# EAGLE design UIAPduino_Pro_Micro_CH32V006_V1dot1 (EAGLE 9.6.2)

## Sheet 1 of 2
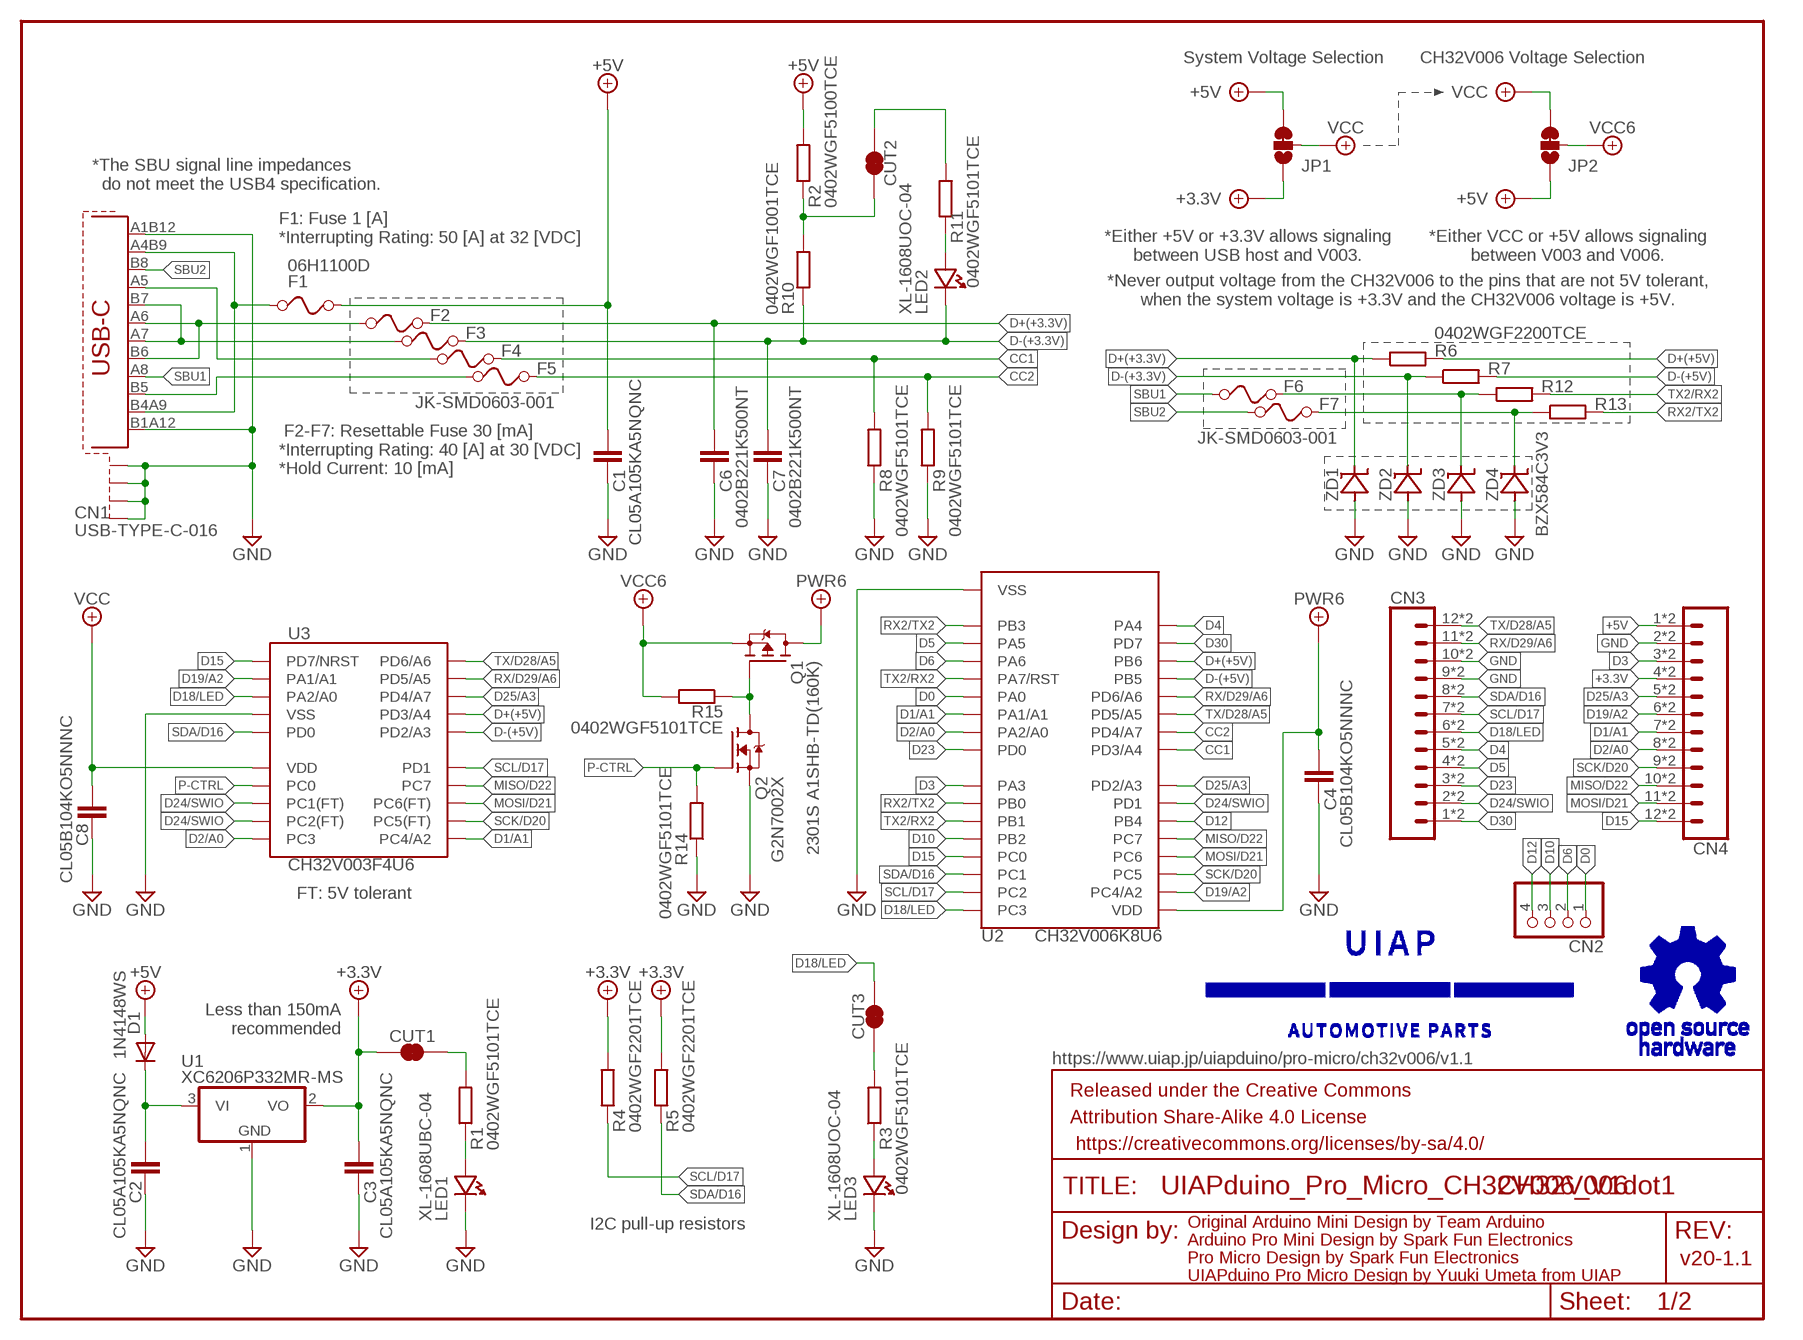
[diagram p0: schematic, sheet 1]

### Parts
C1  CL05A105KA5NQNC  C1005  [1005]
C2  CL05A105KA5NQNC  C1005  [1005]
C3  CL05A105KA5NQNC  C1005  [1005]
C4  CL05B104KO5NNNC  C1005  [1005]
C6  0402B221K500NT  C1005  [1005]
C7  0402B221K500NT  C1005  [1005]
C8  CL05B104KO5NNNC  C1005  [1005]
CN1  USB-TYPE-C-016  [USB-TYPE-C-016]
CN2  PH-2X2  [2X02]
CN3  CONN_12CASTLE_0.9MM  [1X12_CASTELLATED_0.9MM]
CN4  CONN_12CASTLE_0.9MM  [1X12_CASTELLATED_0.9MM]
CUT1  SMT-JP-2-NC  [SMT-JUMPER_2_NC_SILK_ROUND]
CUT2  SMT-JP-2-NC  [SMT-JUMPER_2_NC_SILK_ROUND]
CUT3  SMT-JP-2-NC  [SMT-JUMPER_2_NC_SILK_ROUND]
D1  1N4148WS  1N4148WT  [SOD-523]
F1  06H1100D  [1608]
F2  JK-SMD0603-001  06H1100D  [1608]
F3  JK-SMD0603-001  06H1100D  [1608]
F4  JK-SMD0603-001  06H1100D  [1608]
F5  JK-SMD0603-001  06H1100D  [1608]
F6  JK-SMD0603-001  06H1100D  [1608]
F7  JK-SMD0603-001  06H1100D  [1608]
FRAME1  FRAME-LETTER  [CREATIVE_COMMONS]
JP1  SMT-JP-3-NO-NC  [SMT-JUMPER_3_1-NC_TRACE_SILK]
JP2  SMT-JP-3-NO-NC  [SMT-JUMPER_3_1-NC_TRACE_SILK]
LED1  XL-1608UBC-04  [1608-LED]
LED2  XL-1608UOC-04  [1608-LED]
LED3  XL-1608UOC-04  [1608-LED]
Q1  2301S A1SHB-TD(160K)  2301S_A1SHB-TD(160K)  [SOT-23F_TOS-L]
Q2  G2N7002X  [SOT-523]
R1  0402WGF5101TCE  R1005  [1005]
R2  0402WGF5100TCE  R1005  [1005]
R3  0402WGF5101TCE  R1005  [1005]
R4  0402WGF2201TCE  R1005  [1005]
R5  0402WGF2201TCE  R1005  [1005]
R6  0402WGF2200TCE  R1005  [1005]
R7  0402WGF2200TCE  R1005  [1005]
R8  0402WGF5101TCE  R1005  [1005]
R9  0402WGF5101TCE  R1005  [1005]
R10  0402WGF1001TCE  R1005  [1005]
R11  0402WGF5101TCE  R1005  [1005]
R12  0402WGF2200TCE  R1005  [1005]
R13  0402WGF2200TCE  R1005  [1005]
R14  0402WGF5101TCE  R1005  [1005]
R15  0402WGF5101TCE  R1005  [1005]
U1  XC6206P332MR-MS  [SOT-23F_TOS-L]
U2  CH32V006K8U6  [QFN32-400X400X100]
U3  CH32V003F4U6  CH32V003F4U6-L  [QFN20-300X300X100-L]
ZD1  BZX584C3V3  [SOD-523]
ZD2  BZX584C3V3  [SOD-523]
ZD3  BZX584C3V3  [SOD-523]
ZD4  BZX584C3V3  [SOD-523]

### Nets
+3.3V [vcc]: C3.1 CN4.4 CN4.4B CUT1.2 JP1.1 R4.2 R5.2 U1.2(VO)
+5V [vcc]: C1.1 CN4.1 CN4.1B D1.2(A) F1.2 JP1.3 JP2.1 R2.2
CC1: F4.2 R8.2 U2.25(PD3/A4)
CC2: F5.2 R9.2 U2.26(PD4/A7)
CUT1: CUT1.1 R1.2
D0: CN2.1 U2.5(PA0)
D1 [vcc]: C2.1 D1.1(C) U1.3(VI)
D1/A1: CN4.7 CN4.7B U2.6(PA1/A1) U3.11(PC4/A2)
D2/A0: CN4.8 CN4.8B U2.7(PA2/A0) U3.10(PC3)
D3: CN4.3 CN4.3B U2.9(PA3)
D4: CN3.5 CN3.5B U2.32(PA4)
D5: CN3.4 CN3.4B U2.2(PA5)
D6: CN2.2 U2.3(PA6)
D10: CN2.3 U2.12(PB2)
D12: CN2.4 U2.22(PB4)
D15: CN4.12 CN4.12B U2.13(PC0) U3.1(PD7/NRST)
D18/LED: CN3.6 CN3.6B CUT3.1 U2.16(PC3) U3.3(PA2/A0)
D19/A2: CN4.6 CN4.6B U2.18(PC4/A2) U3.2(PA1/A1)
D23: CN3.3 CN3.3B U2.8(PD0)
D24/SWIO: CN3.2 CN3.2B U2.23(PD1) U3.8(PC1(FT)) U3.9(PC2(FT))
D25/A3: CN4.5 CN4.5B U2.24(PD2/A3) U3.18(PD4/A7)
D30: CN3.1 CN3.1B U2.31(PD7)
D+(+3.3V): C6.1 F2.2 R6.1 ZD1.1(C)
D+(+5V): R6.2 U2.30(PB6) U3.17(PD3/A4)
D-(+3.3V): C7.1 F3.2 LED2.2(C) R7.1 R10.1 ZD2.1(C)
D-(+5V): R7.2 U2.29(PB5) U3.16(PD2/A3)
F1 [vcc]: CN1.A4B9(VBUS) CN1.B4A9(VBUS) F1.1
GND [GND]: C1.2 C2.2 C3.2 C4.2 C6.2 C7.2 C8.2 CN1.A1B12(GND) CN1.B1A12(GND) CN1.S1 CN1.S1B(S1) CN1.S2 CN1.S2B(S2) CN1.S3 CN1.S3B(S3) CN1.S4 CN1.S4B(S4) CN3.9 CN3.9B CN3.10 CN3.10B CN4.2 CN4.2B LED1.2(C) LED3.2(C) Q2.2(S) R8.1 R9.1 R14.1 U1.1(GND) U2.0(VSS) U2.P-VIA$1(VSS) U2.P-VIA$5(VSS) U2.P-VIA$6(VSS) U2.P-VIA$8(VSS) U2.P-VIA$9(VSS) U3.4(VSS) U3.21(VSS) U3.P-VIA$1(VSS) ZD1.2(A) ZD2.2(A) ZD3.2(A) ZD4.2(A)
MISO/D22: CN4.10 CN4.10B U2.21(PC7) U3.14(PC7)
MOSI/D21: CN4.11 CN4.11B U2.20(PC6) U3.13(PC6(FT))
N$1: CN1.A6(DP1) CN1.B6(DP2) F2.1
N$2: CUT2.2 R2.1 R10.2
N$3: Q1.1(G) Q2.3(D) R15.1
N$4: CN1.A7(DN1) CN1.B7(DN2) F3.1
N$5: CN1.A5(CC1) F4.1
N$6: F6.2 R12.1 ZD3.1(C)
N$7: LED3.1(A) R3.1
N$8: CN1.B5(CC2) F5.1
N$9: LED2.1(A) R11.1
N$10: CUT3.2 R3.2
N$11: CUT2.1 R11.2
N$12: F7.2 R13.1 ZD4.1(C)
N$38: LED1.1(A) R1.1
P-CTRL: Q2.1(G) R14.2 U3.7(PC0)
PWR6 [vcc]: C4.1 Q1.3(D) U2.17(VDD)
RX2/TX2: R13.2 U2.1(PB3) U2.10(PB0)
RX/D29/A6: CN3.11 CN3.11B U2.28(PD6/A6) U3.19(PD5/A5)
SBU1: CN1.A8(SBU1) F6.1
SBU2: CN1.B8(SBU2) F7.1
SCK/D20: CN4.9 CN4.9B U2.19(PC5) U3.12(PC5(FT))
SCL/D17: CN3.7 CN3.7B R4.1 U2.15(PC2) U3.15(PD1)
SDA/D16: CN3.8 CN3.8B R5.1 U2.14(PC1) U3.5(PD0)
TX2/RX2: R12.2 U2.4(PA7/RST) U2.11(PB1)
TX/D28/A5: CN3.12 CN3.12B U2.27(PD5/A5) U3.20(PD6/A6)
VCC [vcc]: C8.1 JP1.2 JP2.3 U3.6(VDD)
VCC6 [vcc]: JP2.2 Q1.2(S) R15.2

### Notes on the sheet
- System Voltage Selection | CH32V006 Voltage Selection
- *The SBU signal line impedances
    do not meet the USB4 specification.
- F1: Fuse 1 [A]
  *Interrupting Rating: 50 [A] at 32 [VDC]
- *Either +5V or +3.3V allows signaling
  between USB host and V003.
- *Either VCC or +5V allows signaling
  between V003 and V006.
- *Never output voltage from the CH32V006 to the pins that are not 5V tolerant,
  when the system voltage is +3.3V and the CH32V006 voltage is +5V.
- F2-F7: Resettable Fuse 30 [mA]
  *Interrupting Rating: 40 [A] at 30 [VDC]
  *Hold Current: 10 [mA]
- FT: 5V tolerant
- Less than 150mA
  recommended
- https://www.uiap.jp/uiapduino/pro-micro/ch32v006/v1.1
- CH32V006
- Original Arduino Mini Design by Team Arduino
- I2C pull-up resistors | Arduino Pro Mini Design by Spark Fun Electronics
- Pro Micro Design by Spark Fun Electronics
- UIAPduino Pro Micro Design by Yuuki Umeta from UIAP | v20-1.1

## Sheet 2 of 2
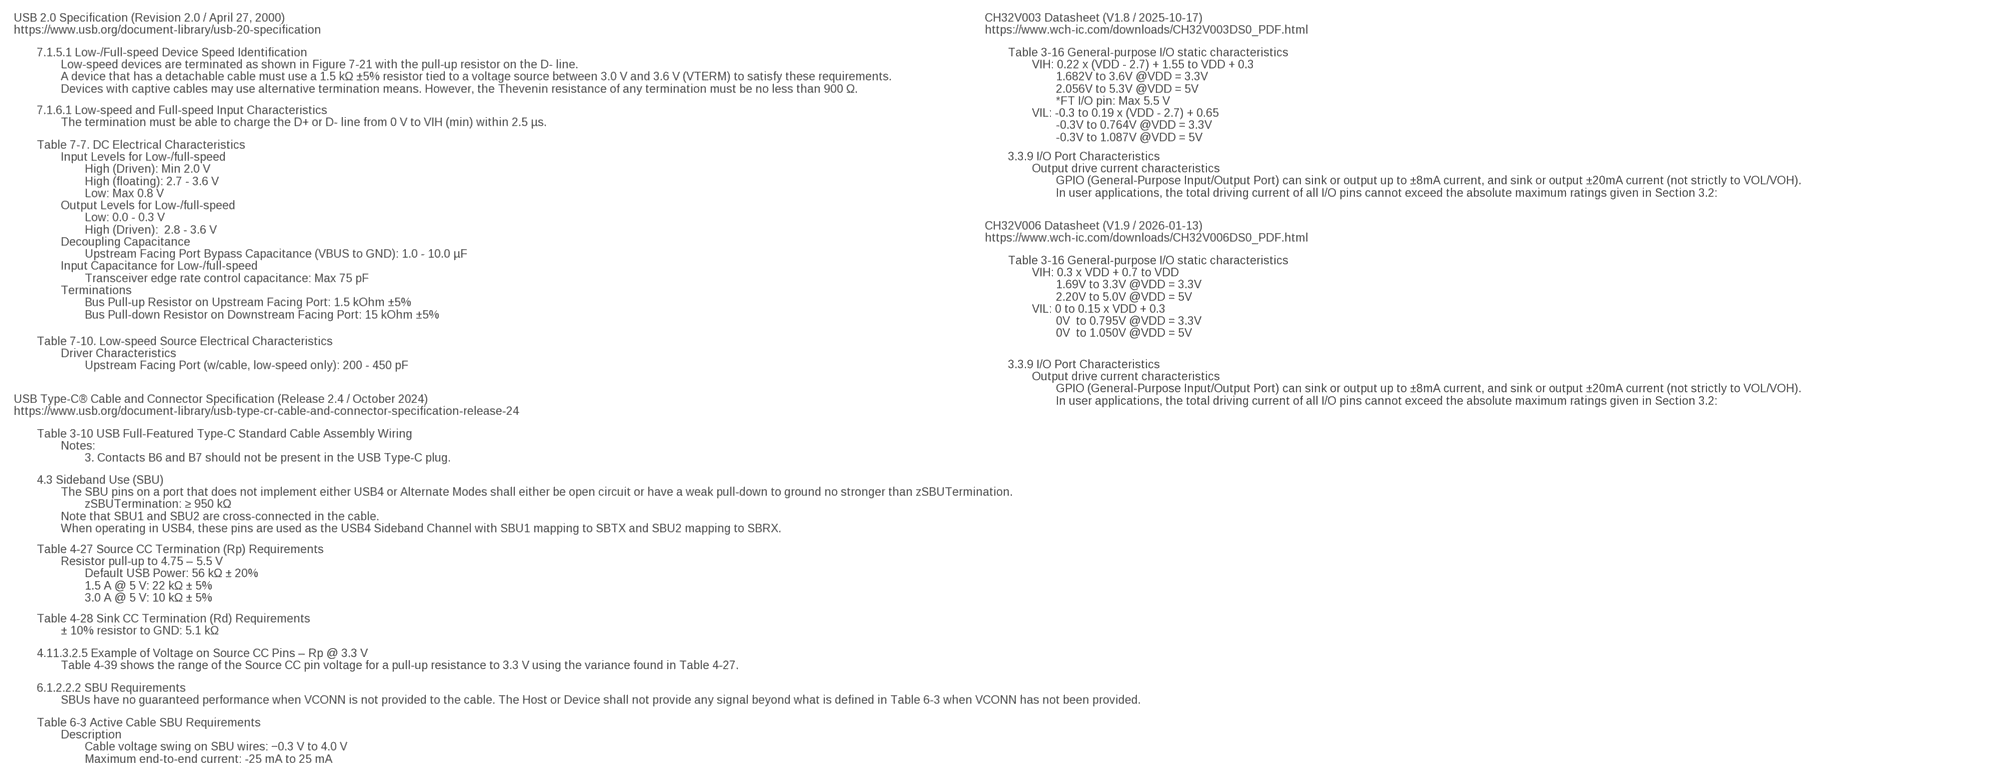
[diagram p1: schematic, sheet 2]

### Notes on the sheet
- USB 2.0 Specification (Revision 2.0 / April 27, 2000)
  https://www.usb.org/document-library/usb-20-specification
- CH32V003 Datasheet (V1.8 / 2025-10-17)
  https://www.wch-ic.com/downloads/CH32V003DS0_PDF.html
- 7.1.5.1 Low-/Full-speed Device Speed Identification
          Low-speed devices are terminated as shown in Figure 7-21 with the pull-up resistor on the D- line.
          A device that has a detachable cable must use a 1.5 kΩ ±5% resistor tied to a voltage source between 3.0 V and 3.6 V (VTERM) to satisfy these requirements.
          Devices with captive cables may use alternative termination means. However, the Thevenin resistance of any termination must be no less than 900 Ω.
- Table 3-16 General-purpose I/O static characteristics
          VIH: 0.22 x (VDD - 2.7) + 1.55 to VDD + 0.3
                  1.682V to 3.6V @VDD = 3.3V
                  2.056V to 5.3V @VDD = 5V
                  *FT I/O pin: Max 5.5 V
          VIL: -0.3 to 0.19 x (VDD - 2.7) + 0.65
                  -0.3V to 0.764V @VDD = 3.3V
                  -0.3V to 1.087V @VDD = 5V
- 7.1.6.1 Low-speed and Full-speed Input Characteristics
          The termination must be able to charge the D+ or D- line from 0 V to VIH (min) within 2.5 µs.
- Table 7-7. DC Electrical Characteristics
          Input Levels for Low-/full-speed
                  High (Driven): Min 2.0 V
                  High (floating): 2.7 - 3.6 V
                  Low: Max 0.8 V
          Output Levels for Low-/full-speed
                  Low: 0.0 - 0.3 V
                  High (Driven):  2.8 - 3.6 V
          Decoupling Capacitance
                  Upstream Facing Port Bypass Capacitance (VBUS to GND): 1.0 - 10.0 µF
          Input Capacitance for Low-/full-speed
                  Transceiver edge rate control capacitance: Max 75 pF
          Terminations
                  Bus Pull-up Resistor on Upstream Facing Port: 1.5 kOhm ±5%
                  Bus Pull-down Resistor on Downstream Facing Port: 15 kOhm ±5%
- 3.3.9 I/O Port Characteristics
          Output drive current characteristics
                  GPIO (General-Purpose Input/Output Port) can sink or output up to ±8mA current, and sink or output ±20mA current (not strictly to VOL/VOH).
                  In user applications, the total driving current of all I/O pins cannot exceed the absolute maximum ratings given in Section 3.2:
- CH32V006 Datasheet (V1.9 / 2026-01-13)
  https://www.wch-ic.com/downloads/CH32V006DS0_PDF.html
- Table 3-16 General-purpose I/O static characteristics
          VIH: 0.3 x VDD + 0.7 to VDD
                  1.69V to 3.3V @VDD = 3.3V
                  2.20V to 5.0V @VDD = 5V
          VIL: 0 to 0.15 x VDD + 0.3
                  0V  to 0.795V @VDD = 3.3V
                  0V  to 1.050V @VDD = 5V
- Table 7-10. Low-speed Source Electrical Characteristics
          Driver Characteristics
                  Upstream Facing Port (w/cable, low-speed only): 200 - 450 pF
- 3.3.9 I/O Port Characteristics
          Output drive current characteristics
                  GPIO (General-Purpose Input/Output Port) can sink or output up to ±8mA current, and sink or output ±20mA current (not strictly to VOL/VOH).
                  In user applications, the total driving current of all I/O pins cannot exceed the absolute maximum ratings given in Section 3.2:
- USB Type-C® Cable and Connector Specification (Release 2.4 / October 2024)
  https://www.usb.org/document-library/usb-type-cr-cable-and-connector-specification-release-24
- Table 3-10 USB Full-Featured Type-C Standard Cable Assembly Wiring
          Notes:
                  3. Contacts B6 and B7 should not be present in the USB Type-C plug.
- 4.3 Sideband Use (SBU)
          The SBU pins on a port that does not implement either USB4 or Alternate Modes shall either be open circuit or have a weak pull-down to ground no stronger than zSBUTermination.
                  zSBUTermination: ≥ 950 kΩ
          Note that SBU1 and SBU2 are cross-connected in the cable.
          When operating in USB4, these pins are used as the USB4 Sideband Channel with SBU1 mapping to SBTX and SBU2 mapping to SBRX.
- Table 4-27 Source CC Termination (Rp) Requirements
          Resistor pull-up to 4.75 – 5.5 V
                  Default USB Power: 56 kΩ ± 20%
                  1.5 A @ 5 V: 22 kΩ ± 5%
                  3.0 A @ 5 V: 10 kΩ ± 5%
- Table 4-28 Sink CC Termination (Rd) Requirements
          ± 10% resistor to GND: 5.1 kΩ
- 4.11.3.2.5 Example of Voltage on Source CC Pins – Rp @ 3.3 V
          Table 4-39 shows the range of the Source CC pin voltage for a pull-up resistance to 3.3 V using the variance found in Table 4-27.
- 6.1.2.2.2 SBU Requirements
          SBUs have no guaranteed performance when VCONN is not provided to the cable. The Host or Device shall not provide any signal beyond what is defined in Table 6-3 when VCONN has not been provided.
- Table 6-3 Active Cable SBU Requirements
          Description
                  Cable voltage swing on SBU wires: −0.3 V to 4.0 V
                  Maximum end-to-end current: -25 mA to 25 mA

## Library data of the parts
C1-C4 C6-C8 = Mylib_e2:C
CN1 = Mylib_e2:USB-TYPE-C; JLCPCB-PART-#: C2927036; URL: https://jlcpcb.com/partdetail/DEALON-USB_TYPE_C016/C2927036
CN2 = Mylib_e2:PH-2X2
CN3 CN4 = Castellated:CONN_12: Multi connection point. Often used as Generic Header-pin footprint for 0.1 inch spaced/style header connections On any of the 0.1 inch spaced packages, you can populate with these: Break Away Headers - Straight <https://www.sparkfun.com/products/116> (PRT-00116) Break Away Male Headers - Right Angle <https://www.sparkfun.com/products/553> (PRT-00553) Female Headers <https://www.sparkfun.com/products/115> (PRT-00115) Break Away Headers - Machine Pin <https://www.sparkfun.com/products/117> (PRT-00117) Break Away Female Headers - Swiss Machine Pin <https://www.sparkfun.com/products/743> (PRT-00743) For SCREWTERMINALS and SPRING TERMINALS visit here: Screw Terimnals on SparkFun.com <https://www.sparkfun.com/search/results?term=Screw+Terminals> (5mm/3.5mm/2.54mm spacing) This device is also useful as a general connection point to wire up your design to another part of your project. Our various solder wires solder well into these plated through hole pads. Hook-Up Wire - Assortment (Stranded, 22 AWG) <https://www.sparkfun.com/products/11375> (PRT-11375) Hook-Up Wire - Assortment (Solid Core, 22 AWG) <https://www.sparkfun.com/products/11367> (PRT-11367) View the entire wire category on our website here <https://www.sparkfun.com/categories/141> Special notes: Molex polarized connector foot print use with SKU : PRT-08231 with associated crimp pins and housings. 1MM SMD Version SKU: PRT-10208 NOTES ON THE VARIANTS LOCK and LOCK_LONGPADS... This footprint was designed to help hold the alignment of a through-hole component (i.e. 6-pin header) while soldering it into place. You may notice that each hole has been shifted either up or down by 0.005 of an inch from it's more standard position (which is a perfectly straight line). This slight alteration caused the pins (the squares in the middle) to touch the edges of the holes. Because they are alternating, it causes a "brace" to hold the component in place. 0.005 has proven to be the perfect amount of "off-center" position when using our standard breakaway headers. Although looks a little odd when you look at the bare footprint, once you have a header in there, the alteration is very hard to notice. Also,if you push a header all the way into place, it is covered up entirely on the bottom side.
CUT1-CUT3 = Mylib_e2:SMT-JP-2-NC
D1 = Mylib_e2:1N4148WT; JLCPCB-PART-#: C917006; URL: https://jlcpcb.com/partdetail/JSMSEMI-1N4148WT/C917006
F1 = Mylib_e2:06H1100D; JLCPCB-PART-#: C182303; URL: https://jlcpcb.com/partdetail/Shenzhen_lansonElec-06H1100D/C182303
F2-F7 = Mylib_e2:06H1100D; JLCPCB-PART-#: C2687114; URL: https://jlcpcb.com/partdetail/2790518-Jinrui_JK_SMD0603001/C2687114
FRAME1 = SparkFun-Aesthetics:FRAME-LETTER: Schematic Frame - Letter Standard 8.5x11 US Letter frame
JP1 JP2 = Mylib_e2:SMT-JP-3-NO-NC
LED1 = Mylib_e2:XL-1608UBC-04; JLCPCB-PART-#: C965807; URL: https://jlcpcb.com/partdetail/C965807
LED2 LED3 = Mylib_e2:XL-1608UOC-04; JLCPCB-PART-#: C965801; URL: https://jlcpcb.com/partdetail/C965801
Q1 = Mylib_e2:2301S_A1SHB-TD(160K); JLCPCB-PART-#: C53064164; URL: https://jlcpcb.com/partdetail/TDSEMIC-2301S_A1SHB_TD_160K/C53064164
Q2 = Mylib_e2:G2N7002X; JLCPCB-PART-#: C5258971; URL: https://jlcpcb.com/partdetail/GOFORD-G2N7002X/C5258971
R1-R15 = Mylib_e2:R
U1 = Mylib_e2:XC6206P332MR-MS; JLCPCB-PART-#: C5252899; URL: https://jlcpcb.com/partdetail/C5252899
U2 = Mylib_e2:CH32V006K8U6: https://www.wch-ic.com/downloads/CH32V00XRM_PDF.html https://www.wch-ic.com/downloads/CH32V006DS0_PDF.html
U3 = Mylib_e2:CH32V003F4U6: https://www.wch-ic.com/downloads/file/358.html
ZD1-ZD4 = Mylib_e2:BZX584C3V3; JLCPCB-PART-#: C7528992; URL: https://jlcpcb.com/partdetail/amsem-BZX584C3V3/C7528992

## Net classes
0 default: width 0.203 mm
1 vcc: width 0.305 mm
2 GND: width 0.508 mm

## Board
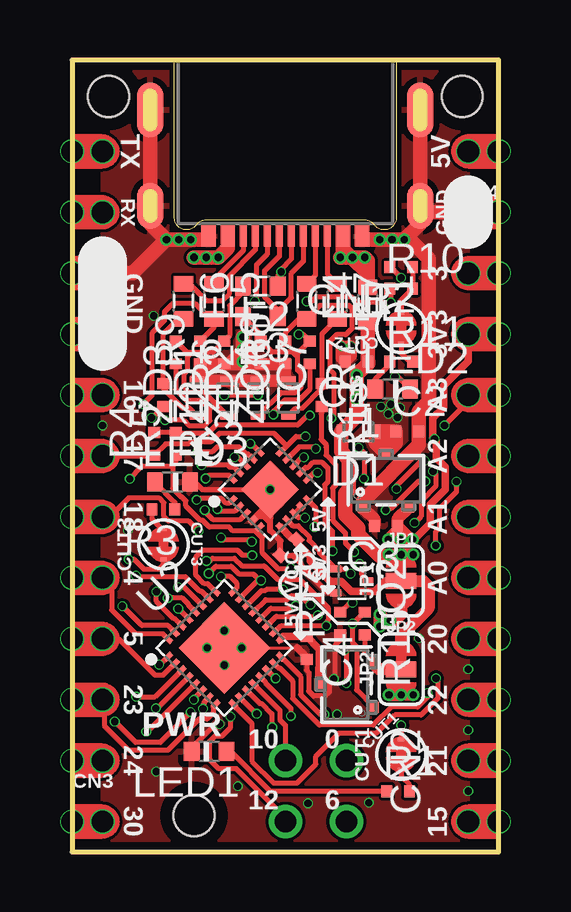
[diagram p2: board, top side]
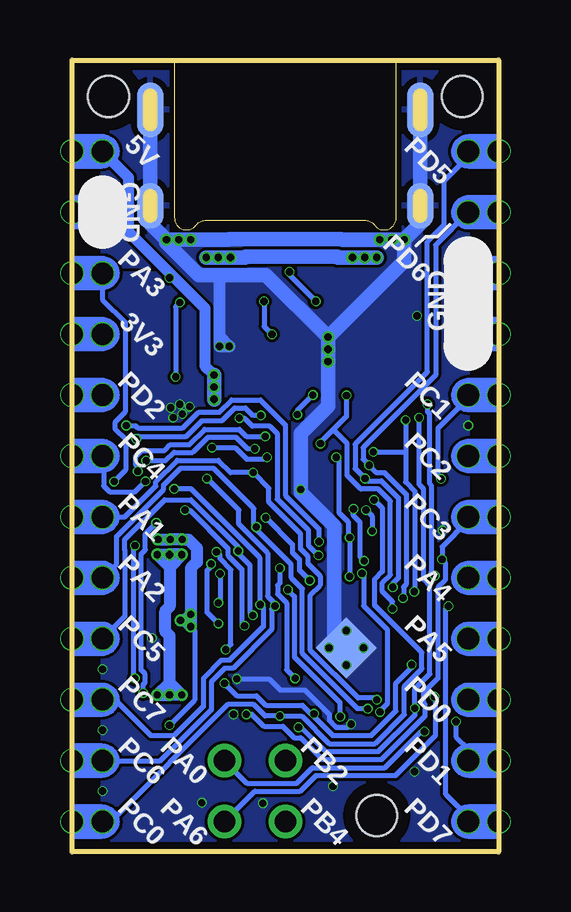
[diagram p3: board, bottom side, seen from below]

Size 17.78 x 33.02 mm. Coordinates in mm from the lower left corner, seen from the top.
Outline: 0,33.02 0,0 17.78,0 17.78,33.02 0,33.02
Copper layers (1*16): Top 0.035mm / dielectric 1.5mm / Bottom 0.035mm
Design rules "SparkFun-2-layer-FAB-LIMIT *": minimum track width 5mil, minimum drill 0.3mm, track to track 5mil, track to pad 5mil, pad to pad 5mil, via to via 5mil, smd to smd 4mil, copper to edge 0.3mm, drill to drill 0.5mil, minimum pad ring 0.05mm, minimum via ring 0.05mm, stop-mask expansion 2mil, vias tented up to drill 25mil, thermal gap 10mil
Holes 1.7 mm at 1.52,31.5 16.26,31.5 5.08,1.52
tRestrict: area 0.1,30.1 to 2.9,32.9; area 14.9,30.1 to 17.7,32.9; area 3.7,0.1 to 6.5,2.9; area -2.5,0 to 0,33; area 17.8,0 to 20.3,33
bRestrict: area 0.1,30.1 to 2.9,32.9; area 14.9,30.1 to 17.7,32.9; area 3.7,0.1 to 6.5,2.9; area -2.5,0 to 0,33; area 17.8,0 to 20.3,33

### Footprints (pad centres in the part's own frame; a part is rotated, then mirrored left to right if it is on the bottom)
1005 = smd 0.45 x 0.5: 1 -0.475,0; 2 0.475,0
USB-TYPE-C-016 = smd 0.6 x 0.9: A1B12 -3.2,2.685; A4B9 -2.4,2.685; B1A12 3.2,2.685; B4A9 2.4,2.685 | smd 0.3 x 0.9: A5 -1.25,2.685; A6 -0.25,2.685; A7 0.25,2.685; A8 1.25,2.685; B5 1.75,2.685; B6 0.75,2.685; B7 -0.75,2.685; B8 -1.75,2.685 | smd 1.1 x 1.9: S1 -5.62,1.435; S2 5.62,1.435 | smd 1.1 x 1.9 bottom: S1B -5.62,1.435; S2B 5.62,1.435 | smd 1.1 x 2.3: S3 -5.62,-2.565; S4 5.62,-2.565 | smd 1.1 x 2.3 bottom: S3B -5.62,-2.565; S4B 5.62,-2.565
2X02 = drill 0.9 pad 1.4: 1 -3.81,0; 2 -1.27,0; 3 -3.81,-2.54; 4 -1.27,-2.54
1X12_CASTELLATED_0.9MM = drill 0.9 pad 1.016: 1 0,0; 2 0,2.54; 3 0,5.08; 4 0,7.62; 5 0,10.16; 6 0,12.7; 7 0,15.24; 8 0,17.78; 9 0,20.32; 10 0,22.86; 11 0,25.4; 12 0,27.94 | drill 0.9 pad 0.95: 1B -1.27,0; 2B -1.27,2.54; 3B -1.27,5.08; 4B -1.27,7.62; 5B -1.27,10.16; 6B -1.27,12.7; 7B -1.27,15.24; 8B -1.27,17.78; 9B -1.27,20.32; 10B -1.27,22.86; 11B -1.27,25.4; 12B -1.27,27.94
SMT-JUMPER_2_NC_SILK_ROUND = smd 0.152 x 0.305: 1 -0.635,0; 2 0.635,0
SOD-523 = smd 0.35 x 0.6: 1 -0.725,0; 2 0.725,0
1608 = smd 0.8 x 0.65: 1 0,-0.725; 2 0,0.725
SMT-JUMPER_3_1-NC_TRACE_SILK = smd 0.152 x 0.305: 1 -1.041,0; 3 1.041,0 | smd 0.66 x 1.27: 2 0,0
1608-LED = smd 0.8 x 0.65: 1 0,-0.725; 2 0,0.725
SOT-23F_TOS-L = smd 0.457 x 0.406: 1 -0.95,-1.143; 2 0.95,-1.143; 3 0,1.143
SOT-523 = smd 0.3 x 0.45: 1 -0.5,-0.675; 2 0.5,-0.675; 3 0,0.675
QFN32-400X400X100 = smd 1.8 x 1.8 bottom: 0 0,0 | smd 0.375 x 0.22: 1 -1.913,1.4; 2 -1.913,1; 3 -1.913,0.6; 4 -1.913,0.2; 5 -1.913,-0.2; 6 -1.913,-0.6; 7 -1.913,-1; 8 -1.913,-1.4; 17 1.913,-1.4; 18 1.913,-1; 19 1.913,-0.6; 20 1.913,-0.2; 21 1.913,0.2; 22 1.913,0.6; 23 1.913,1; 24 1.913,1.4 | smd 0.22 x 0.375: 9 -1.4,-1.913; 10 -1,-1.913; 11 -0.6,-1.913; 12 -0.2,-1.913; 13 0.2,-1.913; 14 0.6,-1.913; 15 1,-1.913; 16 1.4,-1.913; 25 1.4,1.913; 26 1,1.913; 27 0.6,1.913; 28 0.2,1.913; 29 -0.2,1.913; 30 -0.6,1.913; 31 -1,1.913; 32 -1.4,1.913 | smd 2.7 x 2.7: P-VIA$1 0,0 | drill 0.3 pad 0.35: P-VIA$5 -0.508,0.508; P-VIA$6 0.508,0.508; P-VIA$8 -0.508,-0.508; P-VIA$9 0.508,-0.508
QFN20-300X300X100-L = smd 0.375 x 0.22: 1 -1.413,0.8; 2 -1.413,0.4; 3 -1.413,0; 4 -1.413,-0.4; 5 -1.413,-0.8; 11 1.413,-0.8; 12 1.413,-0.4; 13 1.413,0; 14 1.413,0.4; 15 1.413,0.8 | smd 0.22 x 0.375: 6 -0.8,-1.413; 7 -0.4,-1.413; 8 0,-1.413; 9 0.4,-1.413; 10 0.8,-1.413; 16 0.8,1.413; 17 0.4,1.413; 18 0,1.413; 19 -0.4,1.413; 20 -0.8,1.413 | smd 1.7 x 1.7: 21 0,0 | drill 0.3 pad 0.35: P-VIA$1 0,0

### Placement (x,y rotation side)
C1  11.86,20.45 180 top
C2  13.97,17.53 0 top
C3  13.08,13.59 180 top
C4  9.78,8.51 270 top
C6  6.35,20.83 270 top
C7  7.87,20.83 270 top
C8  9.02,12.7 225 top
CN1  8.89,28.37 180 top
CN2  11.43,0 270 top
CN3  1.27,1.27 0 top
CN4  16.51,29.21 180 top
CUT1  13.72,4.06 90 top
CUT2  13.72,21.84 90 top
CUT3  3.81,12.83 90 top
D1  11.94,17.53 180 top
F1  12.32,22.81 180 top
F2  7.85,23.6 90 top
F3  7.85,22.33 90 top
F4  9.78,22.96 180 top
F5  5.92,22.96 180 top
F6  4.65,22.96 180 top
F7  11.05,22.96 180 top
FRAME1  -20.32,-12.7 0 top  (outside the outline)
JP1  13.72,11.3 90 top
JP2  13.72,7.62 90 top
LED1  5.71,4.19 90 top
LED2  13.36,19.3 270 top
LED3  4.19,15.43 270 top
Q1  11.43,6.99 90 top
Q2  11.66,11.3 270 top
R1  13.59,2.54 0 top
R2  13.72,24.38 180 top
R3  3.81,14.29 180 top
R4  3.43,17.02 90 top
R5  4.32,17.02 90 top
R6  4.32,20.83 270 top
R7  9.91,20.83 270 top
R8  8.89,20.83 90 top
R9  5.33,20.83 90 top
R10  13.72,23.5 0 top
R11  13.72,20.45 0 top
R12  3.81,19.05 270 top
R13  10.41,19.05 270 top
R14  11.18,9.53 90 top
R15  12.19,9.53 270 top
U1  13.08,15.49 0 top
U2  6.35,8.51 45 top
U3  8.26,15.11 45 top
ZD1  6.48,18.92 90 top
ZD2  7.75,18.92 90 top
ZD3  5.21,18.92 90 top
ZD4  9.02,18.92 90 top

### Tracks (layer width: path | path; a pad name or v marks a point on that pad's centre or on a via)
+3.3V  (via drill 0.3 pad 0.4, 0.3 pad 0.5)
  Top 0.203: R4.2 R5.2 4.37,17.44 5.66,17.44 6.02,17.79 9.4,17.79 9.81,18.2 v9.91,18.2 | v13.72,5.28 CUT1.2
  Top 0.305: CN4.4 16.51,20.47 15.49,19.46 15.49,18.54 15.04,18.09 15.04,17.29 v15.1,17.22 15.18,17.15 15.18,16.42 15.54,16.06 15.54,15.1 14.93,14.48 14.93,13.7 14.26,13.03 v14.2,13.03
  Top 0.508: U1.2 13.56,13.88 C3.1 | 13.08,9.65 v12.83,9.91 v12.83,9.4 13.08,9.65 | 13.08,9.65 v13.26,9.65 13.45,9.65 13.72,9.91 JP1.1 | C3.1 13.56,13.4 v13.18,13.03 v13.69,13.03 v14.2,13.03 14.12,13.03 C3.1
  Bottom 0.203: v12.83,9.4 12.67,9.24 12.67,6.33 v13.72,5.28 | v9.91,18.2 10.24,18.2 10.56,18.52 11,18.52 11.53,17.98 12.36,17.98 13.02,17.32 15,17.32 v15.1,17.22
  Bottom 0.508: v12.83,9.91 v12.83,9.4 13.08,9.65 | v13.26,9.65 13.08,9.65 | 13.08,9.65 v12.83,9.91 | v14.2,13.03 v13.69,13.03 v13.18,13.03 12.93,13.03 12.57,12.68 12.57,12.09 12.83,11.84 v12.83,9.91
+5V  (via drill 0.3 pad 0.4, 0.3 pad 0.5)
  Top 0.203: R2.2 13.27,24.38 v13.72,23.94
  Top 0.508: v13.21,6.55 v13.72,6.55 | v14.22,6.55 v13.72,6.55 | JP2.1 v13.72,6.55 | v13.21,12.39 v13.72,12.39 | v14.22,12.39 v13.72,12.39 | JP1.3 v13.72,12.39
  Top 0.61: F1.2 12.32,20.46 C1.1 12.34,20.37 v11.86,19.9 v11.86,19.89 v11.86,19.38 v11.86,18.87 11.86,18.18 D1.2 11.21,16.69 11.53,16.37 11.53,15.08 11.39,14.95 11.39,14.04 11.92,13.52 11.92,13.25 12.82,12.34 JP1.3
  Bottom 0.203: v13.72,23.94 13.62,24.04 13.61,24.04
  Bottom 0.457: CN4.1 15.42,28.12 15.42,25.85 13.61,24.04 12.24,22.68 12.24,20.27 v11.86,19.89
  Bottom 0.508: v13.72,6.55 v13.21,6.55 13.72,7.06 | v13.72,6.55 v14.22,6.55 13.72,7.06 | v13.72,6.55 13.72,7.06 | 13.72,7.06 13.72,9.02 13.89,9.2 13.89,10.06 13.72,10.24 13.72,11.89 | v13.72,12.39 v13.21,12.39 13.72,11.89 | v13.72,12.39 v14.22,12.39 13.72,11.89 | 13.72,11.89 v13.72,12.39
  Bottom 0.61: v11.86,18.87 v11.86,19.38 v11.86,19.89
CC1  (via drill 0.3 pad 0.4)
  Top 0.203: R8.2 8.89,21.65 9.47,22.24 F4.2 10.34,22.8 11.54,22.8 11.68,22.66 11.68,21.84 11.4,21.57 11.02,21.57 10.74,21.29 10.74,20.12 10.9,19.96 10.9,18.18 v10.8,18.09 | U2.25 5.66,11.18 5.52,11.18 5.16,11.54 5.16,12.31 5.43,12.57 6.91,12.57 7.11,12.37 v7.51,12.37
  Bottom 0.203: v10.8,18.09 10.6,18.09 10.27,17.75 9.54,17.75 9.23,17.45 9.23,14.72 7.92,13.41 7.92,12.76 7.53,12.37 v7.51,12.37
CC2  (via drill 0.3 pad 0.4)
  Top 0.203: R9.2 5.92,21.89 F5.2 5.76,22.24 5.13,22.86 4.19,22.86 3.85,22.52 3.85,22.15 3.33,21.63 3.33,19.02 v2.97,18.67 | U2.26 5.4,10.87 5.32,10.87 4.73,11.47 2.71,11.47 v2.66,11.52
  Bottom 0.203: v2.97,18.67 2.97,18.36 2.89,18.28 2.89,15.37 2.81,15.3 2.81,11.67 v2.66,11.52
CUT1
  Top 0.203: R1.2 14.06,2.79 13.72,3.14 CUT1.1
D0  (via drill 0.3 pad 0.4)
  Top 0.203: v3.1,5.02 3.15,5.02 U2.5
  Bottom 0.203: v3.1,5.02 3.23,5.02 4.75,3.51 7.76,3.51 8.41,2.87 10.49,2.87 CN2.1
D1  (via drill 0.3 pad 0.4)
  Top 0.61: U1.3 13.49,17.05 C2.1 13.08,17.53 | 13.08,17.53 D1.1 12.66,17.05 U1.3 | U1.3 13.08,17.53
  other vias: 13.18,18.26 12.88,18.57 13.28,18.67 13.67,18.52 13.56,18.11
  pour Top (no thermals): 11.86,19.63 11.86,18.19 11.23,17.53 11.23,16.66 11.53,16.36 11.53,15.06 12.55,15.06 14.45,16.94 14.45,18.39 14.86,18.82 14.86,19.63
  pour Bottom: 11.86,17.32 11.86,22.3 13.69,24.13 16.51,24.13 16.51,17.32
D1/A1  (via drill 0.3 pad 0.4)
  Top 0.203: U3.11 10.09,15.82 v10.23,15.82 | U2.6 5.08,6.39 v5.08,6.35
  Bottom 0.203: v5.08,6.35 5.15,6.42 5.86,6.42 7.85,8.41 7.85,10.71 7.44,11.12 7.44,11.52 7.94,12.01 7.94,12.31 8.25,12.62 8.25,13.27 9.57,14.59 9.57,15.16 v10.23,15.82 11.17,15.82 11.68,16.33 13.4,16.33 14.29,15.44 14.29,15.26 15.57,13.97 CN4.7
D2/A0  (via drill 0.3 pad 0.4)
  Top 0.203: U3.10 10.15,14.35 10.15,13.6 v10.1,13.55 | U2.7 5.51,6.25 5.51,6.17 5.46,6.12 v5.46,5.97
  Bottom 0.203: v5.46,5.97 5.88,5.97 8.18,8.28 8.18,10.98 8.66,11.45 8.66,12.01 10.1,13.45 v10.1,13.55 10.2,13.65 10.2,14.32 11.88,16 13.27,16 13.96,15.3 13.96,15.12 15.92,13.16 15.92,12.02 CN4.8
D3  (via drill 0.3 pad 0.4)
  Top 0.203: v16.02,15.44 v16.03,15.44 16.03,15.02 15.31,14.3 15.31,13.51 15.15,13.36 v15.15,12.78 | U2.9 6.71,6.14 7.5,5.36 7.5,3.79 8.4,2.88 9.38,2.88 10.16,3.66 10.16,3.99 11.13,4.96 12.7,4.96 13.45,5.71 14.55,5.71 15.24,6.4 15.24,7.17 v15.16,7.24
  Bottom 0.203: CN4.3 16.51,23.04 15.57,22.1 15.57,18.34 15.97,17.93 15.97,17.61 15.55,17.19 15.55,15.92 v16.02,15.44 | v15.16,7.24 15.23,7.31 15.23,12.7 v15.15,12.78
D4
  Top 0.203: U2.32 3.79,9.09 2.65,9.09 1.65,10.09 1.65,11.05 CN3.5
D5
  Top 0.203: U2.2 3.81,7.38 3.45,7.38 1.95,8.89 CN3.4
D6  (via drill 0.3 pad 0.4)
  Top 0.203: U2.3 3.46,6.47 v2.68,6.47
  Bottom 0.203: v2.68,6.47 2.65,6.45 2.65,4.84 4.31,3.18 7.63,3.18 8.27,2.54 10.16,2.54 CN2.2
D10
  Top 0.203: U2.12 8.66,5.92 8.66,5.51 8.89,5.28 CN2.3
D12  (via drill 0.3 pad 0.4)
  Top 0.203: CN2.4 8.89,1.42 6.83,3.48 6.1,3.48 5.71,3.86 5.71,4.6 5.94,4.83 6.25,4.83 6.6,5.18 v6.6,5.64 | v8.79,10.94 8.1,10.94 8.05,10.89 7.89,10.89 U2.22
  Bottom 0.203: v8.79,10.94 8.51,10.66 8.51,8.13 6.6,6.22 v6.6,5.64
D15  (via drill 0.3 pad 0.4)
  Top 0.203: U3.1 6.54,14.53 6.43,14.53 6.23,14.73 5.24,14.73 v5.19,14.68 | U2.13 8.05,7.09 8.05,7.06 9.12,6 v9.12,5.67
  Bottom 0.203: v5.19,14.68 4.85,14.33 4.85,11.7 5.17,11.37 5.17,10.29 3.2,8.32 3.2,7.63 3.93,6.9 3.93,5.74 5.15,4.52 7.06,4.52 8.21,5.67 v9.12,5.67 9.73,5.67 10.23,6.17 11.26,6.17 16.17,1.27 CN4.12
D18/LED  (via drill 0.3 pad 0.4)
  Top 0.203: v10.52,5.74 10.34,5.74 9.53,6.56 9.53,7.31 U2.16 | v5.53,14.25 5.53,14.2 5.86,13.87 7.01,13.87 U3.3 | CUT3.1 3.81,11.98 3.63,11.8 2.99,11.8 2.59,12.2 v2.36,12.2 | v5.28,13.38 4.86,13.8 4.02,13.8 3.83,13.98 3.83,14.55 3.61,14.78 2.38,14.78 1.57,13.97 CN3.6
  Bottom 0.203: v5.53,14.25 5.28,14 v5.28,13.38 | v10.52,5.74 10.29,5.74 9.79,5.24 9,5.24 8.52,4.77 8.26,4.77 7.35,3.86 4.88,3.86 3.07,5.67 3.07,6.17 3.12,6.22 3.12,6.66 2.54,7.24 2.54,11.02 2.23,11.33 2.23,12.08 v2.36,12.2 2.36,12.72 1.27,13.82 CN3.6
D19/A2  (via drill 0.3 pad 0.4)
  Top 0.203: U3.2 6.78,14.2 6.15,14.2 v6.05,14.3 | U2.18 8.44,9.15 8.72,9.44 v10.59,9.44 v10.6,9.43 10.6,9.59 10.67,9.66 10.67,10.18 9.48,11.37 8.57,11.37 8.01,11.93 7.08,11.93 6.77,12.24 5.86,12.24 5.75,12.13 v5.61,12.13 | v13.07,14.26 13.14,14.33 13.3,14.33 13.76,14.78 13.77,14.78 14.44,15.45 v14.72,15.45
  Bottom 0.203: v10.6,9.43 10.7,9.54 10.7,11.79 11.28,12.37 11.28,12.66 12.88,14.26 v13.07,14.26 | v5.61,12.13 5.78,12.31 5.78,13.75 6.05,14.02 v6.05,14.3 | CN4.6 16.46,16.46 16.46,15.27 16.2,15.01 15.16,15.01 v14.72,15.45
D23
  Top 0.203: U2.8 5.88,6.06 5.88,5.8 5.63,5.54 5.29,5.54 3.99,4.24 2.37,4.24 1.35,5.27 1.35,6.27 CN3.3
D24/SWIO  (via drill 0.3 pad 0.4)
  Top 0.203: v4.95,5.84 3.96,4.85 3.96,4.84 3.68,4.57 2.65,4.57 v1.78,5.44 | U3.9 | U3.9 U3.8 9.43,13.94 v9.71,13.94 | U2.23 7.75,11.32 v7.87,11.32 7.82,11.32 7.57,11.58 6.97,11.58 6.63,11.91 6,11.91 v5.7,11.61
  Bottom 0.203: v7.87,11.32 8.31,11.76 8.31,12.2 8.59,12.49 8.59,12.82 v9.71,13.94 | v5.7,11.61 5.63,11.55 5.63,10.27 4.65,9.29 4.65,6.17 4.95,5.88 v4.95,5.84 | CN3.2 1.27,4.29 1.78,4.8 v1.78,5.44
D25/A3  (via drill 0.3 pad 0.4)
  Top 0.203: v6.21,13.11 6.31,13.01 7.42,13.01 v7.49,12.94 | v6.77,16.46 6.91,16.46 U3.18 | U2.24 6.88,11.02 6.88,11.2 6.59,11.49 v6.21,11.49 | CN4.5 16.51,18.77 v15.52,17.78
  Bottom 0.203: v15.52,17.78 15.14,17.78 15.04,17.68 13.16,17.68 12.5,18.34 11.64,18.34 11.13,18.85 9.93,18.85 8.89,17.8 8.89,14.87 7.49,13.47 v7.49,12.94 | v6.21,11.49 v6.21,13.11 6.26,13.16 6.26,13.75 6.65,14.14 6.65,16.34 v6.77,16.46
D30  (via drill 0.3 pad 0.4)
  Top 0.203: U2.31 4.01,9.44 2.91,9.44 v2.1,10.25
  Bottom 0.203: CN3.1 1.27,1.47 2.21,2.41 2.21,10.14 v2.1,10.25
D+(+3.3V)
  Top 0.203: F2.2 7.12,23.34 6.57,22.79 6.57,21.52 C6.1 5.88,20.84 5.02,20.84 | ZD1.1 5.51,19.16 4.89,19.16 4.68,19.38 4.68,19.94 4.83,20.09 4.83,20.64 | R6.1 4.79,20.84 4.83,20.84 | 4.83,20.84 5.02,20.84 | 4.83,20.64 4.83,20.84 | 4.83,20.64 5.02,20.84
D+(+5V)  (via drill 0.3 pad 0.4)
  Top 0.203: R6.2 4.32,19.27 4.75,18.84 5.37,18.84 5.74,18.46 5.74,17.98 5.55,17.79 4.87,17.79 4.65,18.01 v3.88,18.01 | U3.17 7.34,16.6 7.25,16.6 6.96,16.89 6.05,16.89 5.84,16.68 v5.22,16.68 | U2.30 4.29,9.72 4.25,9.72 3.52,10.45 v3.52,10.85
  Bottom 0.203: v3.88,18.01 3.88,16.64 | 3.88,16.64 3.88,15.42 3.49,15.04 3.49,10.88 v3.52,10.85 | v5.22,16.68 3.92,16.68 3.88,16.64
D-(+3.3V)  (via drill 0.3 pad 0.4)
  Top 0.203: F3.2 7.87,21.58 C7.1 8.34,20.84 9.21,20.84 | ZD2.1 8.71,19.16 9.33,19.16 9.55,19.38 9.55,19.94 9.4,20.09 9.4,20.64 | 9.4,20.84 9.44,20.84 R7.1 9.63,21.58 v9.45,21.58 | 9.4,20.84 9.21,20.84 | 9.4,20.64 9.4,20.84 | 9.4,20.64 9.21,20.84 | v13.46,19.81 13.58,19.81 LED2.2 | R10.1 13.28,23.45 v13.28,22.91 11.89,22.91 11.67,23.13 10.17,23.13 10.01,22.96 v9.78,22.96
  Bottom 0.203: v13.28,22.91 13.46,22.73 v13.46,19.81 | v9.78,22.96 9.78,21.91 v9.45,21.58
D-(+5V)  (via drill 0.3 pad 0.4)
  Top 0.203: R7.2 9.91,19.27 9.47,18.84 8.85,18.84 8.38,18.37 8.38,18.24 v8.39,18.23 | v7.74,19.05 7.73,19.03 v6.34,19.03 | U3.16 7.47,17.03 v7.43,17.03 | U2.29 v4.43,10.15
  Bottom 0.203: v6.34,19.03 6.34,18.15 6.89,17.61 | v8.39,18.23 8.39,18.4 v7.74,19.05 | v7.43,17.03 7.43,17.07 6.89,17.61 | 6.89,17.61 6.32,17.04 6.32,15.71 5.74,15.13 5.02,15.13 4.52,14.63 4.52,11.56 4.84,11.23 4.84,10.86 4.43,10.45 v4.43,10.15
F1  (via drill 0.3 pad 0.5)
  Top 0.61: v5.08,24.79 v5.59,24.79 v6.1,24.79 6.49,25.18 CN1.B4A9 | v11.68,24.79 v11.18,24.79 11.29,24.9 CN1.A4B9 11.29,25.13 11.61,24.8 11.67,24.8 v11.68,24.79 | v11.68,24.79 v12.19,24.79 12.32,24.66 12.32,24.13 | F1.1 12.32,24.13 | v11.68,24.79 11.68,24.77 12.32,24.13
  Bottom 0.61: v5.08,24.79 v5.59,24.79 v6.1,24.79 6.71,24.79 6.73,24.82 10.54,24.82 10.57,24.79 v11.18,24.79 v11.68,24.79 v12.19,24.79
GND  (via drill 0.3, 0.3 pad 0.4, 0.3 pad 0.5)
  Top 0.127: U2.P-VIA$1 9.38,8.51
  Top 0.203: C4.2 9.78,7.58 9.86,7.5 9.86,6.71 10.07,6.5 10.56,6.5 10.72,6.66 10.72,7.03 v10.91,7.22 10.95,7.25 10.95,8.61 11.18,8.84 R14.1 | Q2.2 10.66,10.8 9.55,11.92 9.55,12.01 9.2,12.36 C8.2 | v6.15,5.33 5.97,5.16 5.8,5.16 4.99,4.34 LED1.2 | LED3.2 5.11,15.43 5.42,15.11 U3.P-VIA$1
  Top 0.254: 8.26,13.74 8.26,13.4 8.68,12.98 C8.2 | 8.26,13.74 8,13.99 7.7,13.99 | U3.P-VIA$1 8.26,13.89 | 8.26,13.74 8.26,13.89 | 8.26,13.89 7.93,14.22
  Top 0.305: 9.38,8.51 9.78,8.12 C4.2 | U3.4 7.7,13.99 7.93,14.22 8.26,14.55 U3.P-VIA$1
  Top 0.508: U1.1 12.61,13.88 C3.2 | C6.2 R9.1 5.33,19.77 ZD3.2 ZD1.2 ZD2.2 ZD4.2 8.89,19.77 R8.1 C7.2 | C6.2 7.02,20.35 v7.11,20.45 7.21,20.35 C7.2 | C6.2 C7.2 | C6.2 6.51,20.35 v7.11,20.95 7.71,20.35 C7.2 | C1.2 11.63,20.69 v11.63,21.08 v11.23,21.08 11.23,20.61 C1.2
  Top 0.61: CN1.S4B CN1.S2B 3.27,26.19 v3.94,25.53 | CN1.S3 CN1.S1 | v3.94,25.53 v4.45,25.53 v4.95,25.53 5.53,25.53 CN1.B1A12 | CN1.S1 14.51,26.19 v13.84,25.53 | v13.84,25.53 v13.34,25.53 v12.83,25.53 12.25,25.53 CN1.A1B12 | CN3.9 CN3.10 2.54,24.13 v3.94,25.53 | U1.1 12.13,14.64 14.45,16.96 C2.2 14.45,18.36 14.86,18.78 14.86,24.74 14.08,25.53 v13.84,25.53 | CN1.S1 14.78,26.67 CN4.2 | v7.11,21.46 v7.11,20.95 v7.11,20.45
  Bottom 0.203: v10.91,7.22 9.56,7.22 9.1,6.76 8.08,6.76 7.06,5.74 7.06,5.49 6.78,5.21 6.27,5.21 v6.15,5.33
  Bottom 0.508: 11.63,21.49 v11.63,21.08 v11.23,21.08 11.63,21.49 | 11.63,21.49 11.63,24.05
  Bottom 0.61: CN1.S4B CN1.S2B 3.27,26.19 v3.94,25.53 | CN1.S3 CN1.S1 14.51,26.19 v13.84,25.53 | v3.94,25.53 v4.45,25.53 v4.95,25.53 6.53,25.53 6.55,25.55 11.23,25.55 11.25,25.53 v12.83,25.53 v13.34,25.53 v13.84,25.53 | CN3.10 CN3.9 | v13.84,25.53 13.84,25.4 12.5,24.05 11.63,24.05 9.7,24.05 v7.11,21.46 | U2.P-VIA$1 6.86,9.02 6.86,13.59 8.26,14.99 U3.P-VIA$1 8.26,17.46 7.11,18.6 v7.11,20.45 v7.11,20.95 v7.11,21.46 | v7.11,21.46 3.94,24.64 v3.94,25.53
  other vias: 1.27,17.78 1.27,20.32 16.51,27.94 2.34,13.41 3.4,22.35 3.51,3.35 6.91,2.74 12.37,2.06 9.83,2.03 1.27,25.4 1.27,22.86 11.05,5.74 16.51,25.4 14.45,8.92 16.51,7.62 16.51,5.08 16.51,2.54
  cutout Top: 12.88,10.75 12.88,11.86 arc-90 13.72,12.69 arc-90 14.55,11.86 14.55,10.75 arc-90 13.72,9.91 arc-90
  cutout Top: 4.19,33.02 13.59,33.02 arc-90 13.72,32.89 13.72,25.91 arc-90 13.59,25.78 4.19,25.78 arc-90 4.06,25.91 4.06,32.89 arc-90
  cutout Bottom: 4.19,33.02 13.59,33.02 arc-90 13.72,32.89 13.72,25.91 arc-90 13.59,25.78 4.19,25.78 arc-90 4.06,25.91 4.06,32.89 arc-90
  cutout Top: 12.7,21.84 arc-90 13.72,22.86 arc-90 14.73,21.84 arc-90 13.72,20.83 arc-90
  cutout Top: 12.7,4.06 arc-90 13.72,5.08 arc-90 14.73,4.06 arc-90 13.72,3.05 arc-90
  cutout Top: 12.88,7.07 12.88,8.17 arc-90 13.72,9.01 arc-90 14.55,8.17 14.55,7.07 arc-90 13.72,6.23 arc-90
  cutout Top: 2.79,12.83 arc-90 3.81,13.84 arc-90 4.83,12.83 arc-90 3.81,11.81 arc-90
  cutout Top: 8.26,13.12 6.13,15.24 8.26,17.36 10.38,15.24
  cutout Top: 6.35,5.68 3.52,8.51 6.35,11.34 9.18,8.51
  pour Top (rank 6): 1.27,0 16.51,0 16.51,33.02 1.27,33.02
  pour Bottom (rank 6): 1.27,0 16.51,0 16.51,33.02 1.27,33.02
  pour Top (no thermals): 4.65,22.23 9.78,22.23 9.78,18.54 4.65,18.54
MISO/D22  (via drill 0.3 pad 0.4)
  Top 0.203: v10.16,16.81 10.08,16.89 9.46,16.89 U3.14 | U2.21 8.07,10.51 8.97,10.51 9.14,10.69 9.52,10.69 9.91,10.31 v9.94,10.31 | v13.52,15.14 13.52,15.27 14.56,16.31 v14.69,16.31
  Bottom 0.203: CN4.10 15.98,6.35 14.48,4.85 13.54,4.85 12.3,6.09 12.3,7.25 11.54,8 11.2,8 9.81,9.4 9.81,10.18 v9.94,10.31 9.96,10.33 9.96,12.29 12.81,15.14 v13.52,15.14 | v14.69,16.31 13.88,16.31 13.54,16.66 12.75,16.66 12.12,17.29 10.94,17.29 10.46,16.81 v10.16,16.81
MOSI/D21  (via drill 0.3 pad 0.4)
  Top 0.203: v12.16,15.57 v12.17,15.58 12.17,16.63 v11.94,16.86 | U3.13 9.6,16.46 v9.66,16.46 | U2.20 8.28,10.16 9.22,10.16 v9.32,10.26
  Bottom 0.203: v12.16,15.57 12.13,15.57 10.82,14.26 10.82,13.67 9.62,12.47 9.62,10.66 9.32,10.36 v9.32,10.26 9.46,10.12 9.46,9.27 11.07,7.66 11.42,7.66 11.96,7.11 11.96,5.94 14.1,3.81 CN4.11 | v9.66,16.46 9.73,16.38 10.5,16.38 10.98,16.86 v11.94,16.86
N$1  (via drill 0.3 pad 0.4)
  Top 0.203: CN1.B6 8.14,24.93 7.69,24.48 7.69,23.03 v7.62,22.96 | CN1.A6 9.14,24.74 8.71,24.31 v8.71,24.18 8.57,24.04 F2.1
  Bottom 0.203: v8.71,24.18 8.71,24.06 v7.62,22.96
N$2
  Top 0.203: R2.1 R10.2 13.72,23.02 CUT2.2
N$3  (via drill 0.3 pad 0.4)
  Top 0.203: Q1.1 11.86,6.75 11.86,8.56 11.68,8.73 v11.68,9.53 11.72,9.53 R15.1 | v11.98,12.01 12.05,11.94 12.05,11.58 Q2.3
  Bottom 0.203: v11.98,12.01 11.98,11.91 12.16,11.73 12.16,10.01 v11.68,9.53
N$4
  Top 0.203: CN1.B7 9.64,24.63 9.14,24.13 9.14,23.11 8.57,22.54 | CN1.A7 8.64,24.84 8.02,24.22 8.02,23.15 8.57,22.6 8.57,22.54 | F3.1 8.57,22.54
N$5
  Top 0.203: CN1.A5 10.14,24.05 F4.1
N$6
  Top 0.203: ZD3.1 4.9,18.5 4.62,18.5 3.81,19.31 R12.1 3.81,21.59 4.45,22.24 F6.2
N$7
  Top 0.203: LED3.1 3.47,15.4 4.29,14.58 R3.1
N$8
  Top 0.203: CN1.B5 7.14,25.08 5.92,23.86 F5.1
N$9
  Top 0.203: R11.1 13.24,20.32 12.63,19.71 LED2.1
N$10
  Top 0.203: R3.2 3.33,13.87 3.74,13.46 CUT3.2
N$11
  Top 0.203: CUT2.1 13.72,20.8 14.06,20.45 R11.2
N$12
  Top 0.203: ZD4.1 9.32,18.5 9.61,18.5 10.41,19.31 R13.1 10.41,21.6 F7.2
N$38
  Top 0.203: R1.1 8.26,2.54 6.61,4.19 LED1.1
P-CTRL  (via drill 0.3 pad 0.4)
  Top 0.203: v11.61,11.61 11.41,11.8 Q2.1 10.31,12.47 10.31,12.54 9.88,12.98 9.88,13.15 9.43,13.6 9.2,13.6 U3.7 | R14.2 11.56,10.39 v11.68,10.39
  Bottom 0.203: v11.68,10.39 11.61,10.46 v11.61,11.61
PWR6
  Top 0.305: Q1.3 10.29,7.67 10.31,7.69 10.31,8.46 C4.1 8.8,8.98 U2.17
RX2/TX2  (via drill 0.3 pad 0.4)
  Top 0.203: v11.76,12.51 11.39,12.88 11.39,13.3 10.86,13.82 10.86,15.17 10.99,15.3 10.99,16.14 10.59,16.55 10.59,16.87 10.59,16.99 10.38,17.2 10.38,18.27 10.41,18.3 R13.2 | v7.7,5.77 7.68,5.77 U2.10 | U2.1 3.67,7.81 v3.63,7.81 | v11.38,8.43 11.43,8.38 v11.43,7.04
  Bottom 0.203: v11.43,7.04 10.91,6.51 10.1,6.51 9.7,6.12 8.18,6.12 7.82,5.77 v7.7,5.77 7.7,5.64 6.92,4.86 5.3,4.86 4.29,5.88 4.29,7.04 3.63,7.7 v3.63,7.81 | v11.38,8.43 11.16,8.65 11.16,11.78 11.61,12.23 11.61,12.37 v11.76,12.51
RX/D29/A6  (via drill 0.3 pad 0.4)
  Top 0.203: U3.19 6.77,16.03 6.59,16.03 6.5,16.12 v5.4,16.12 | U2.28 4.85,10.29 4.85,10.33 4.59,10.59 v3.99,10.59
  Bottom 0.203: v3.99,10.59 3.96,10.62 3.96,11.05 3.83,11.18 3.83,14.89 4.77,15.82 5.1,15.82 v5.4,16.12 5.66,16.38 5.66,16.86 2.63,19.88 2.63,25.31 CN3.11
SBU1
  Top 0.203: CN1.A8 7.64,25.11 6.57,24.04 6.57,23.29 6.27,22.99 5.6,22.99 4.9,23.69 F6.1
SBU2
  Top 0.203: CN1.B8 10.64,24.1 F7.1
SCK/D20  (via drill 0.3 pad 0.4)
  Top 0.203: v10.85,12.55 10.85,13.36 10.53,13.69 10.53,15.31 10.66,15.44 10.66,16.01 10.41,16.26 10.06,16.26 9.84,16.03 9.74,16.03 U3.12 | U2.19 8.52,9.83 10.21,9.83 v10.24,9.87
  Bottom 0.203: v10.24,9.87 10.37,9.99 10.37,11.96 10.85,12.45 v10.85,12.55 10.85,12.71 12.83,14.69 13.92,14.69 15.58,13.03 15.58,12.6 15.56,12.58 15.56,9.84 CN4.9
SCL/D17  (via drill 0.3 pad 0.4)
  Top 0.203: v14.81,6.63 14.81,6.45 14.4,6.04 13.31,6.04 12.56,5.29 10.3,5.29 9.2,6.4 9.2,7.13 8.66,7.67 8.61,7.67 U2.15 | U3.15 8.94,16.93 | 8.94,16.93 9.34,17.33 v9.73,17.33 | 8.94,16.93 8.41,17.46 6.16,17.46 5.8,17.11 4.95,17.11 4.86,17.02 3.9,17.02 R4.1 3.4,16.51 CN3.7 | v14.27,13.72 14.54,14 14.54,14.64 15.16,15.26 15.16,15.75 v15.04,15.88
  Bottom 0.203: v9.73,17.33 10.51,17.33 10.8,17.62 12.26,17.62 12.89,16.99 13.68,16.99 13.92,16.74 14.87,16.74 15.12,16.49 15.12,16.13 15.04,16.05 v15.04,15.88 | v14.81,6.63 14.81,6.99 14.73,7.07 14.73,7.42 14.9,7.58 14.9,12.42 14.73,12.6 14.73,13.26 v14.27,13.72
SDA/D16  (via drill 0.3 pad 0.4)
  Top 0.203: U3.5 7.67,13.39 | 7.67,13.39 6.7,13.39 6.55,13.54 5.72,13.54 5.44,13.83 5.35,13.83 4.75,14.43 4.75,14.64 4.58,14.8 4.55,14.8 4.19,15.16 4.19,16.08 | v9.12,11.84 9.08,11.8 8.6,11.8 7.94,12.47 7.94,13.1 7.67,13.37 7.67,13.39 | U2.14 8.47,7.24 v8.48,7.24 | v2.41,15.56 2.92,16.07 4.18,16.07 4.19,16.08 | R5.1 4.32,16.26 4.19,16.14 4.19,16.08
  Bottom 0.203: v9.12,11.84 9.12,11.21 9.22,11.12 9.22,10.76 8.84,10.38 8.84,7.6 v8.48,7.24 | CN3.8 1.27,18.92 2.54,17.65 2.54,15.69 v2.41,15.56
TX2/RX2  (via drill 0.3 pad 0.4)
  Top 0.203: U2.11 7.82,6.19 7.9,6.19 8.33,5.77 8.33,5.22 v8.35,5.2 | U2.4 3.55,5.99 v3.5,5.99 | R12.2 3.79,18.57 v3.32,18.1
  Bottom 0.203: v3.32,18.1 3.32,15.33 3.15,15.16 3.15,11.38 2.87,11.1 2.87,7.43 3.5,6.8 v3.5,5.99 3.5,5.71 5.01,4.19 7.21,4.19 8.22,5.2 v8.35,5.2
TX/D28/A5  (via drill 0.3 pad 0.4)
  Top 0.203: U3.20 6.54,15.7 5.7,15.7 v5.57,15.57 | U2.27 4.67,11.04 v4.42,11.04
  Bottom 0.203: v4.42,11.04 4.42,11.19 4.19,11.42 4.19,14.77 4.89,15.47 5.47,15.47 v5.57,15.57 5.99,15.99 5.99,17 2.97,20.02 2.97,25.45 2.29,26.13 2.29,27.96 1.27,28.98 CN3.12
VCC
  Top 0.305: U3.6 9.14,13.09 9.3,13.09 C8.1 9.35,12.9 9.93,12.32 9.93,12.12 10.77,11.29 11.22,11.29 11.63,10.87 12.62,10.87 13.05,11.3 JP1.2
  Top 0.508: JP1.2 14.63,11.3 14.86,11.07 14.86,10.16 13.72,9.02 JP2.3
VCC6
  Top 0.203: R15.2 12.19,8.32 Q1.2
  Top 0.508: JP2.2 12.79,7.62 12.57,7.83 Q1.2

### Text on the board
tPlace: TX | 5V | RX | GND | 3 | GND | 3V3 | CUT2 | 16 | SIG | A3 | 17 | L | A2 | 18 | 5V | A1 | CUT3 | JP1 | VCC | 3V3 | 4 | A0 | 5V | 5 | JP2 | 20 | 23 | 22 | PWR | CUT1 | 24 | 10 | 0 | 21 | 12 | 6 | 30 | 15
bPlace: PD5 | 5V | GND | PD6 | PA3 | GND | 3V3 | PC1 | PD2 | PC2 | PC4 | PC3 | PA1 | PA4 | PA2 | PA5 | PC5 | PD0 | PC7 | PD1 | PB2 | PA0 | PC6 | PD7 | PB4 | PA6 | PC0
Measures: Units in Inches
tDocu: Yuuki Umeta from UIAP